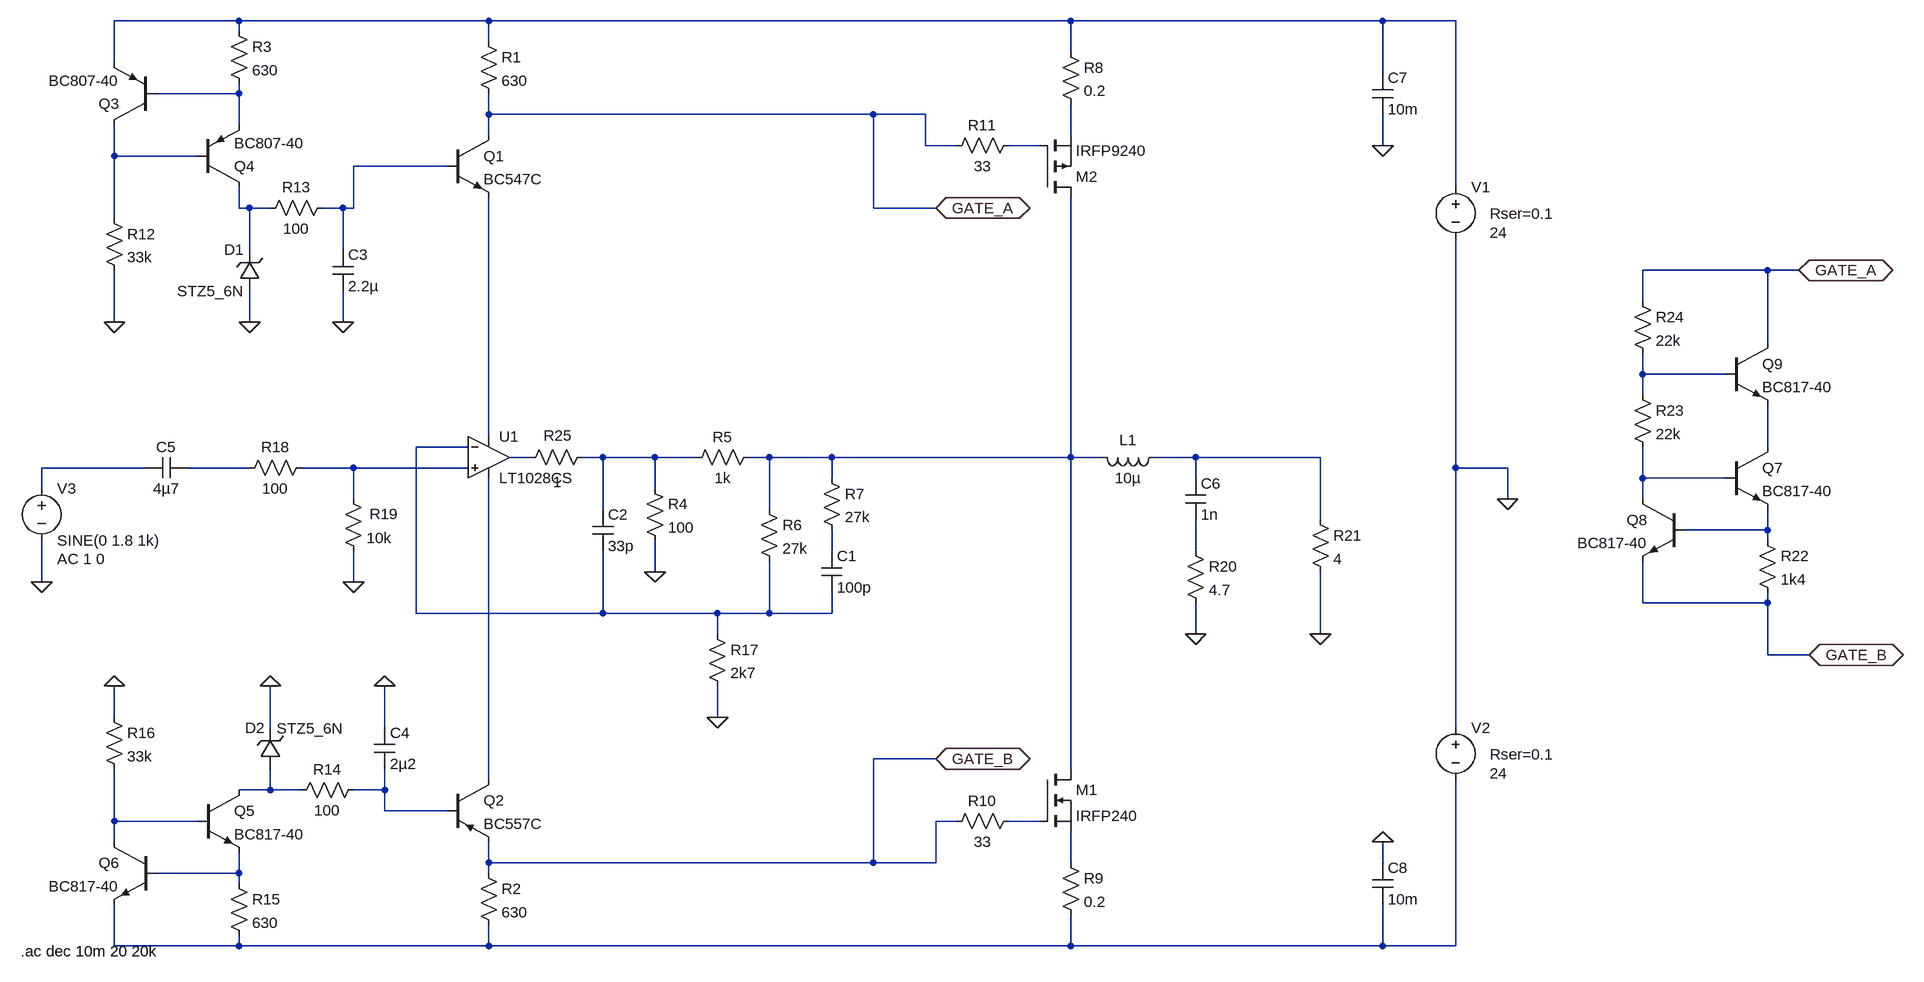
[diagram p0: schematic RSAMP.asc]
RSAMP.asc, the LTspice schematic file:
Version 4
SHEET 1 2504 812
WIRE -64 -640 -256 -640
WIRE 320 -640 -64 -640
WIRE 1216 -640 320 -640
WIRE 1696 -640 1216 -640
WIRE 1808 -640 1696 -640
WIRE -64 -624 -64 -640
WIRE 320 -608 320 -640
WIRE 1216 -592 1216 -640
WIRE -256 -576 -256 -640
WIRE 1696 -560 1696 -640
WIRE -64 -528 -64 -544
WIRE -64 -528 -192 -528
WIRE 320 -496 320 -528
WIRE 912 -496 320 -496
WIRE 992 -496 912 -496
WIRE -64 -480 -64 -528
WIRE 320 -464 320 -496
WIRE 1216 -464 1216 -512
WIRE 992 -448 992 -496
WIRE 1040 -448 992 -448
WIRE 1168 -448 1120 -448
WIRE 1696 -448 1696 -496
WIRE -256 -432 -256 -480
WIRE -128 -432 -256 -432
WIRE 256 -416 112 -416
WIRE 1808 -384 1808 -640
WIRE -64 -352 -64 -384
WIRE -48 -352 -64 -352
WIRE -16 -352 -48 -352
WIRE 96 -352 64 -352
WIRE 112 -352 112 -416
WIRE 112 -352 96 -352
WIRE 912 -352 912 -496
WIRE 1008 -352 912 -352
WIRE -256 -336 -256 -432
WIRE -48 -288 -48 -352
WIRE 96 -288 96 -352
WIRE 2288 -256 2096 -256
WIRE 2336 -256 2288 -256
WIRE 2096 -208 2096 -256
WIRE -256 -176 -256 -256
WIRE -48 -176 -48 -224
WIRE 96 -176 96 -224
WIRE 2288 -144 2288 -256
WIRE 2096 -96 2096 -128
WIRE 2224 -96 2096 -96
WIRE 2096 -64 2096 -96
WIRE 320 0 320 -368
WIRE 288 16 208 16
WIRE 2288 16 2288 -48
WIRE 384 32 352 32
WIRE 496 32 464 32
WIRE 576 32 496 32
WIRE 640 32 576 32
WIRE 752 32 720 32
WIRE 848 32 752 32
WIRE 1216 32 1216 -368
WIRE 1216 32 848 32
WIRE 1264 32 1216 32
WIRE 1408 32 1344 32
WIRE 1600 32 1408 32
WIRE -208 48 -368 48
WIRE -48 48 -144 48
WIRE 112 48 32 48
WIRE 288 48 112 48
WIRE 1808 48 1808 -304
WIRE 1888 48 1808 48
WIRE 848 64 848 32
WIRE 1408 64 1408 32
WIRE 2096 64 2096 16
WIRE 2224 64 2096 64
WIRE -368 80 -368 48
WIRE 576 80 576 32
WIRE 112 96 112 48
WIRE 1888 96 1888 48
WIRE 2096 96 2096 64
WIRE 496 112 496 32
WIRE 752 112 752 32
WIRE 1600 128 1600 32
WIRE 2288 144 2288 112
WIRE 2288 144 2160 144
WIRE 2288 160 2288 144
WIRE 848 176 848 144
WIRE 1408 176 1408 128
WIRE 576 208 576 160
WIRE -368 224 -368 160
WIRE 112 224 112 176
WIRE 2096 256 2096 192
WIRE 2288 256 2288 240
WIRE 2288 256 2096 256
WIRE 208 272 208 16
WIRE 496 272 496 176
WIRE 496 272 208 272
WIRE 672 272 496 272
WIRE 752 272 752 192
WIRE 752 272 672 272
WIRE 848 272 848 240
WIRE 848 272 752 272
WIRE 672 304 672 272
WIRE 1408 304 1408 256
WIRE 1600 304 1600 208
WIRE 2288 336 2288 256
WIRE 2352 336 2288 336
WIRE -256 432 -256 384
WIRE 672 432 672 384
WIRE -16 448 -16 384
WIRE 160 448 160 384
WIRE 1808 448 1808 48
WIRE 1008 496 912 496
WIRE 1216 512 1216 32
WIRE 320 528 320 64
WIRE -16 544 -16 512
WIRE -16 544 -64 544
WIRE 32 544 -16 544
WIRE 160 544 160 512
WIRE 160 544 112 544
WIRE 160 576 160 544
WIRE 256 576 160 576
WIRE -256 592 -256 512
WIRE -128 592 -256 592
WIRE 1040 592 1008 592
WIRE 1168 592 1120 592
WIRE -256 624 -256 592
WIRE 320 656 320 624
WIRE 912 656 912 496
WIRE 912 656 320 656
WIRE 1008 656 1008 592
WIRE 1008 656 912 656
WIRE 1216 656 1216 608
WIRE 1696 656 1696 624
WIRE -64 672 -64 640
WIRE -64 672 -192 672
WIRE 320 672 320 656
WIRE -64 688 -64 672
WIRE -256 784 -256 720
WIRE -64 784 -64 768
WIRE -64 784 -256 784
WIRE 320 784 320 752
WIRE 320 784 -64 784
WIRE 1216 784 1216 736
WIRE 1216 784 320 784
WIRE 1696 784 1696 720
WIRE 1696 784 1216 784
WIRE 1808 784 1808 528
WIRE 1808 784 1696 784
FLAG 1888 96 0
FLAG -48 -176 0
FLAG 576 208 0
FLAG -256 -176 0
FLAG 96 -176 0
FLAG -16 384 0
FLAG 160 384 0
FLAG -256 384 0
FLAG 672 432 0
FLAG 112 224 0
FLAG 1408 304 0
FLAG 1600 304 0
FLAG -368 224 0
FLAG 1696 624 0
FLAG 1696 -448 0
FLAG 1008 -352 GATE_A
IOPIN 1008 -352 BiDir
FLAG 2336 -256 GATE_A
IOPIN 2336 -256 BiDir
FLAG 2352 336 GATE_B
IOPIN 2352 336 BiDir
FLAG 1008 496 GATE_B
IOPIN 1008 496 BiDir
SYMBOL npn 256 -464 R0
SYMATTR InstName Q1
SYMATTR Value BC547C
SYMBOL pnp 256 528 R0
SYMATTR InstName Q2
SYMATTR Value BC557C
SYMBOL res 304 -624 R0
SYMATTR InstName R1
SYMATTR Value 630
SYMBOL res 304 656 R0
SYMATTR InstName R2
SYMATTR Value 630
SYMBOL voltage 1808 -400 R0
WINDOW 3 53 86 Left 2
WINDOW 123 0 0 Left 0
WINDOW 39 53 57 Left 2
SYMATTR Value 24
SYMATTR SpiceLine Rser=0.1
SYMATTR InstName V1
SYMBOL voltage 1808 432 R0
WINDOW 3 53 86 Left 2
WINDOW 123 0 0 Left 0
WINDOW 39 53 57 Left 2
SYMATTR Value 24
SYMATTR SpiceLine Rser=0.1
SYMATTR InstName V2
SYMBOL zener -32 -224 R180
WINDOW 0 24 64 Left 2
WINDOW 3 24 0 Left 2
SYMATTR InstName D1
SYMATTR Value STZ5_6N
SYMBOL res 560 64 R0
SYMATTR InstName R4
SYMATTR Value 100
SYMBOL res 736 16 R90
WINDOW 0 0 56 VBottom 2
WINDOW 3 32 56 VTop 2
SYMATTR InstName R5
SYMATTR Value 1k
SYMBOL res 736 96 R0
SYMATTR InstName R6
SYMATTR Value 27k
SYMBOL res 832 48 R0
SYMATTR InstName R7
SYMATTR Value 27k
SYMBOL cap 832 176 R0
SYMATTR InstName C1
SYMATTR Value 100p
SYMBOL cap 480 112 R0
SYMATTR InstName C2
SYMATTR Value 33p
SYMBOL nmos 1168 512 R0
SYMATTR InstName M1
SYMATTR Value IRFP240
SYMBOL pmos 1168 -368 M180
SYMATTR InstName M2
SYMATTR Value IRFP9240
SYMBOL res 1200 -608 R0
SYMATTR InstName R8
SYMATTR Value 0.2
SYMBOL res 1200 640 R0
SYMATTR InstName R9
SYMATTR Value 0.2
SYMBOL res 1136 576 R90
WINDOW 0 0 56 VBottom 2
WINDOW 3 32 56 VTop 2
SYMATTR InstName R10
SYMATTR Value 33
SYMBOL res 1136 -464 R90
WINDOW 0 0 56 VBottom 2
WINDOW 3 32 56 VTop 2
SYMATTR InstName R11
SYMATTR Value 33
SYMBOL pnp -192 -480 R180
SYMATTR InstName Q3
SYMATTR Value BC807-40
SYMBOL pnp -128 -384 M180
SYMATTR InstName Q4
SYMATTR Value BC807-40
SYMBOL res -80 -640 R0
SYMATTR InstName R3
SYMATTR Value 630
SYMBOL res -272 -352 R0
SYMATTR InstName R12
SYMATTR Value 33k
SYMBOL cap 80 -288 R0
SYMATTR InstName C3
SYMATTR Value 2.2µ
SYMBOL res 80 -368 R90
WINDOW 0 0 56 VBottom 2
WINDOW 3 32 56 VTop 2
SYMATTR InstName R13
SYMATTR Value 100
SYMBOL npn -128 544 R0
SYMATTR InstName Q5
SYMATTR Value BC817-40
SYMBOL npn -192 624 M0
SYMATTR InstName Q6
SYMATTR Value BC817-40
SYMBOL zener 0 512 R180
WINDOW 0 24 64 Left 2
WINDOW 3 -97 63 Left 2
SYMATTR InstName D2
SYMATTR Value STZ5_6N
SYMBOL cap 144 448 R0
SYMATTR InstName C4
SYMATTR Value 2µ2
SYMBOL res 128 528 R90
WINDOW 0 0 56 VBottom 2
WINDOW 3 32 56 VTop 2
SYMATTR InstName R14
SYMATTR Value 100
SYMBOL res -80 672 R0
SYMATTR InstName R15
SYMATTR Value 630
SYMBOL res -272 416 R0
SYMATTR InstName R16
SYMATTR Value 33k
SYMBOL res 656 288 R0
SYMATTR InstName R17
SYMATTR Value 2k7
SYMBOL res 48 32 R90
WINDOW 0 0 56 VBottom 2
WINDOW 3 32 56 VTop 2
SYMATTR InstName R18
SYMATTR Value 100
SYMBOL cap -144 32 R90
WINDOW 0 0 32 VBottom 2
WINDOW 3 32 32 VTop 2
SYMATTR InstName C5
SYMATTR Value 4µ7
SYMBOL res 96 80 R0
WINDOW 0 41 39 Left 2
SYMATTR InstName R19
SYMATTR Value 10k
SYMBOL ind 1360 16 R90
WINDOW 0 5 56 VBottom 2
WINDOW 3 32 56 VTop 2
SYMATTR InstName L1
SYMATTR Value 10µ
SYMBOL cap 1392 64 R0
SYMATTR InstName C6
SYMATTR Value 1n
SYMBOL res 1392 160 R0
SYMATTR InstName R20
SYMATTR Value 4.7
SYMBOL res 1584 112 R0
SYMATTR InstName R21
SYMATTR Value 4
SYMBOL voltage -368 64 R0
WINDOW 123 24 124 Left 2
WINDOW 39 0 0 Left 0
SYMATTR Value2 AC 1 0
SYMATTR InstName V3
SYMATTR Value SINE(0 1.8 1k)
SYMBOL cap 1680 -560 R0
SYMATTR InstName C7
SYMATTR Value 10m
SYMATTR SpiceLine Rser=0.1
SYMBOL cap 1680 656 R0
SYMATTR InstName C8
SYMATTR Value 10m
SYMATTR SpiceLine Rser=0.1
SYMBOL npn 2224 16 R0
SYMATTR InstName Q7
SYMATTR Value BC817-40
SYMBOL npn 2160 96 M0
SYMATTR InstName Q8
SYMATTR Value BC817-40
SYMBOL res 2272 144 R0
SYMATTR InstName R22
SYMATTR Value 1k4
SYMBOL res 2080 -80 R0
SYMATTR InstName R23
SYMATTR Value 22k
SYMBOL npn 2224 -144 R0
SYMATTR InstName Q9
SYMATTR Value BC817-40
SYMBOL res 2080 -224 R0
SYMATTR InstName R24
SYMATTR Value 22k
SYMBOL res 480 16 R90
WINDOW 0 -2 53 VBottom 2
WINDOW 3 38 54 VTop 2
SYMATTR InstName R25
SYMATTR Value 1
SYMBOL OpAmps\\LT1028CS 320 -32 R0
SYMATTR InstName U1
TEXT -400 792 Left 2 !.ac dec 10m 20 20k

The netlist it stands for:
* RSAMP.asc
Q1 GATE_A N006 N009 0 BC547C
Q2 N023 N025 GATE_B 0 BC557C
R1 N001 GATE_A 630
R2 GATE_B N030 630
V1 N001 0 24 Rser=0.1
V2 0 N030 24 Rser=0.1
D1 0 N007 STZ5_6N
R4 N013 0 100
R5 N014 N013 1k
R6 N014 N010 27k
R7 N014 N021 27k
C1 N021 N010 100p
C2 N013 N010 33p
M1 N014 N027 N028 N028 IRFP240
M2 N014 N004 N003 N003 IRFP9240
R8 N001 N003 0.2
R9 N028 N030 0.2
R10 N027 GATE_B 33
R11 N004 GATE_A 33
Q3 N005 N002 N001 0 BC807-40
Q4 N007 N005 N002 0 BC807-40
R3 N001 N002 630
R12 N005 0 33k
C3 N006 0 2.2µ
R13 N006 N007 100
Q5 N024 N026 N029 0 BC817-40
Q6 N026 N029 N030 0 BC817-40
D2 N024 0 STZ5_6N
C4 0 N025 2µ2
R14 N025 N024 100
R15 N029 N030 630
R16 0 N026 33k
R17 N010 0 2k7
R18 N018 N017 100
C5 N017 N016 4µ7
R19 N018 0 10k
L1 N015 N014 10µ
C6 N015 N022 1n
R20 N022 0 4.7
R21 N015 0 4
V3 N016 0 SINE(0 1.8 1k) AC 1 0
C7 N001 0 10m Rser=0.1
C8 0 N030 10m Rser=0.1
Q7 N011 N019 N020 0 BC817-40
Q8 N019 N020 GATE_B 0 BC817-40
R22 N020 GATE_B 1k4
R23 N008 N019 22k
Q9 GATE_A N008 N011 0 BC817-40
R24 GATE_A N008 22k
R25 N013 N012 1
XU1 N018 N010 N009 N023 N012 LT1028CS  ; pins In+ In- V+ V- OUT
.model D D
.lib standard.dio
.model NPN NPN
.model PNP PNP
.lib standard.bjt
.model NMOS NMOS
.model PMOS PMOS
.lib standard.mos
.ac dec 10m 20 20k
.backanno
.end